# EAGLE design LLOAD_DB9_Adapter (EAGLE 6.6.0)
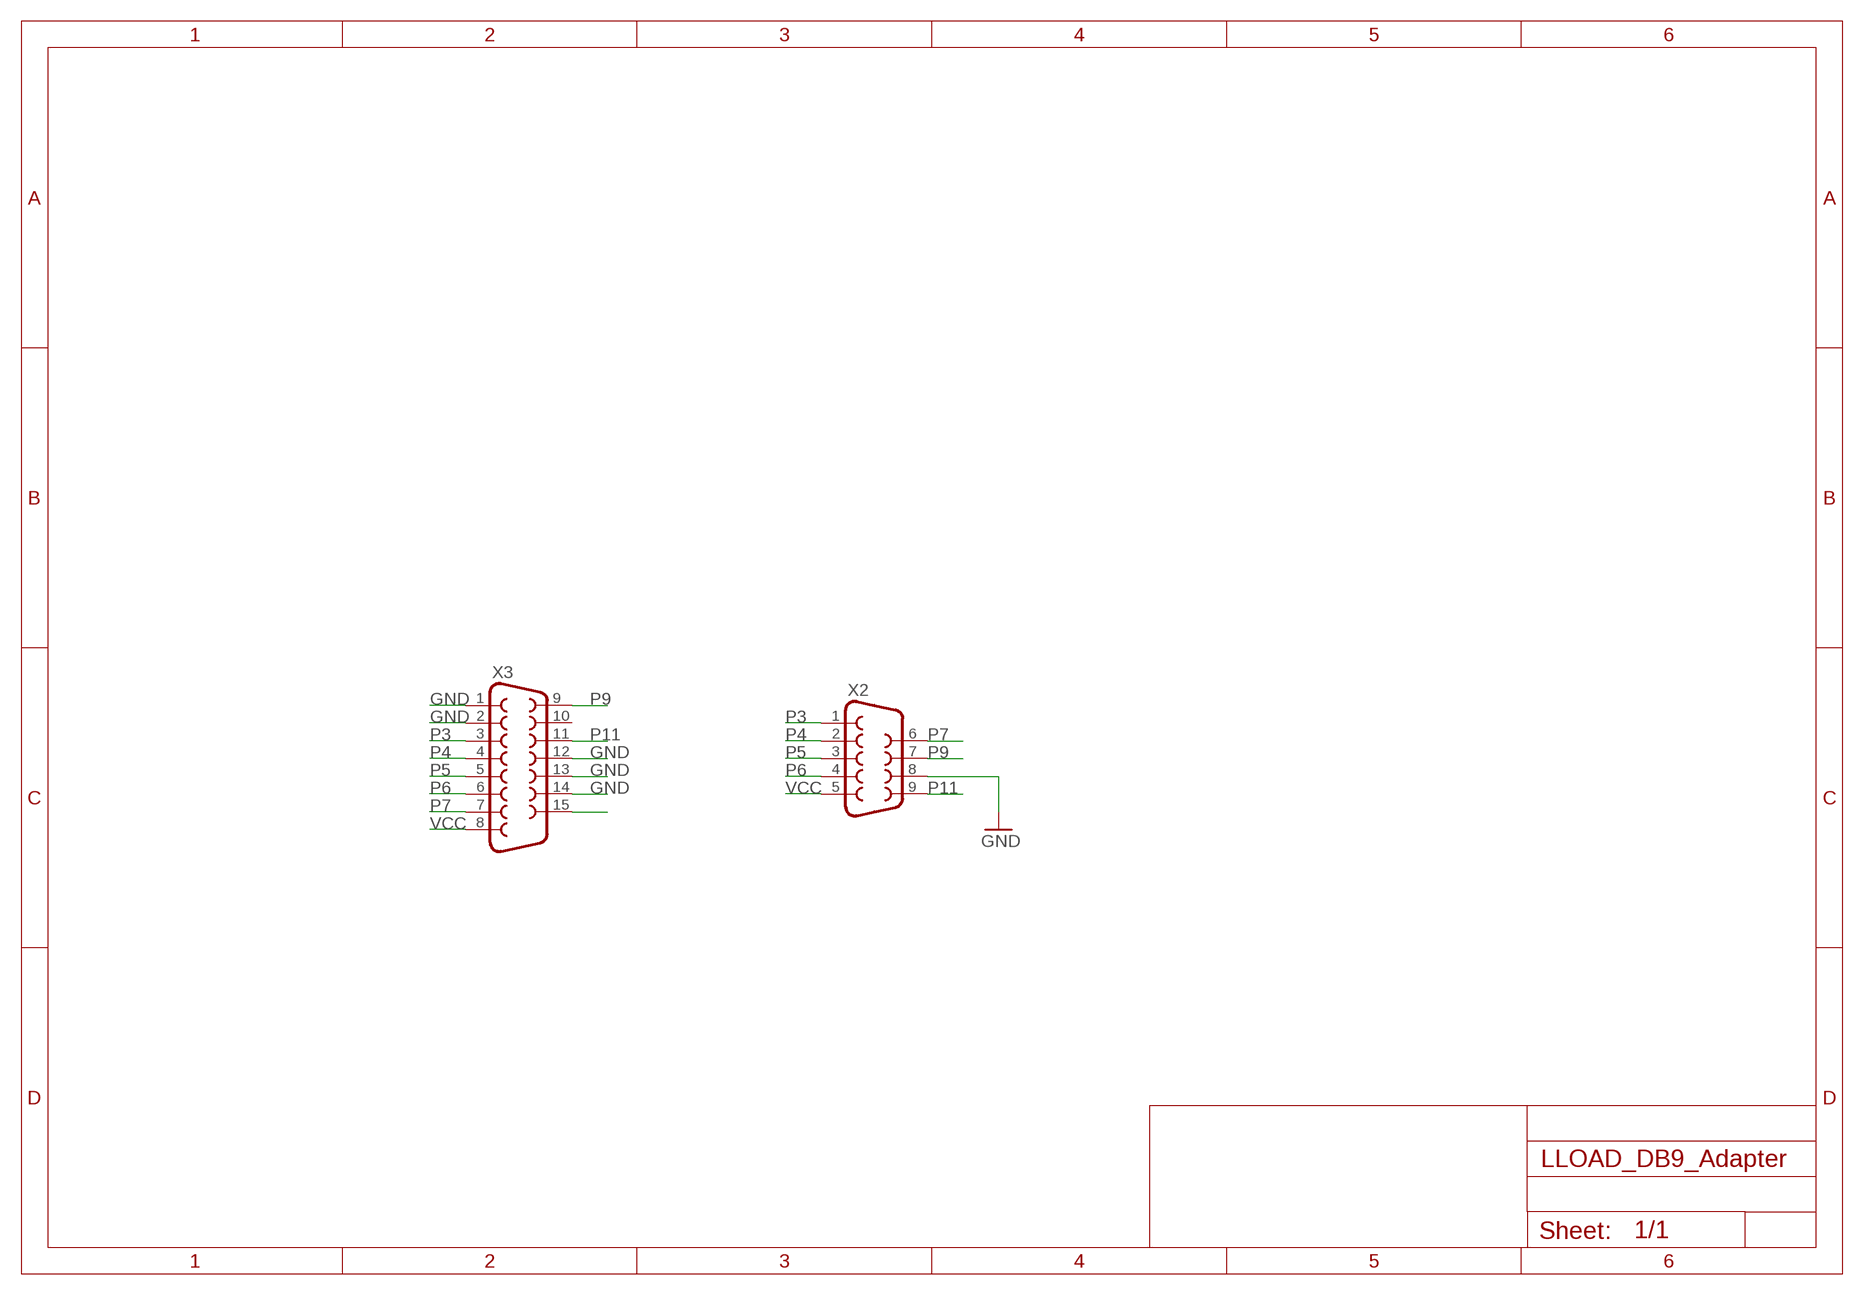
[diagram p0: schematic, sheet 1]

## Parts
X2  DB9MALE  [DB9_MALE]
X3  F15HP  [F15HP]

## Nets
GND: X2.8 X3.1 X3.2 X3.12 X3.13 X3.14
N$4: X3.15
P3: X2.1 X3.3
P4: X2.2 X3.4
P5: X2.3 X3.5
P6: X2.4 X3.6
P7: X2.6 X3.7
P9: X2.7 X3.9
P11: X2.9 X3.11
VCC: X2.5 X3.8
Unconnected: X3.10

## Library data of the parts
X2 = SparkFun:DB9: DB9 Connector Standard DB9 (D-Sub 9) serial connector. Can be used for CAN bus as well as RS485 and RS232. Footprint production proven. Spark Fun Electronics SKU : PRT-00429
X3 = con-subd:F15: SUB-D; OC_FARNELL: unknown; OC_NEWARK: unknown

## Board
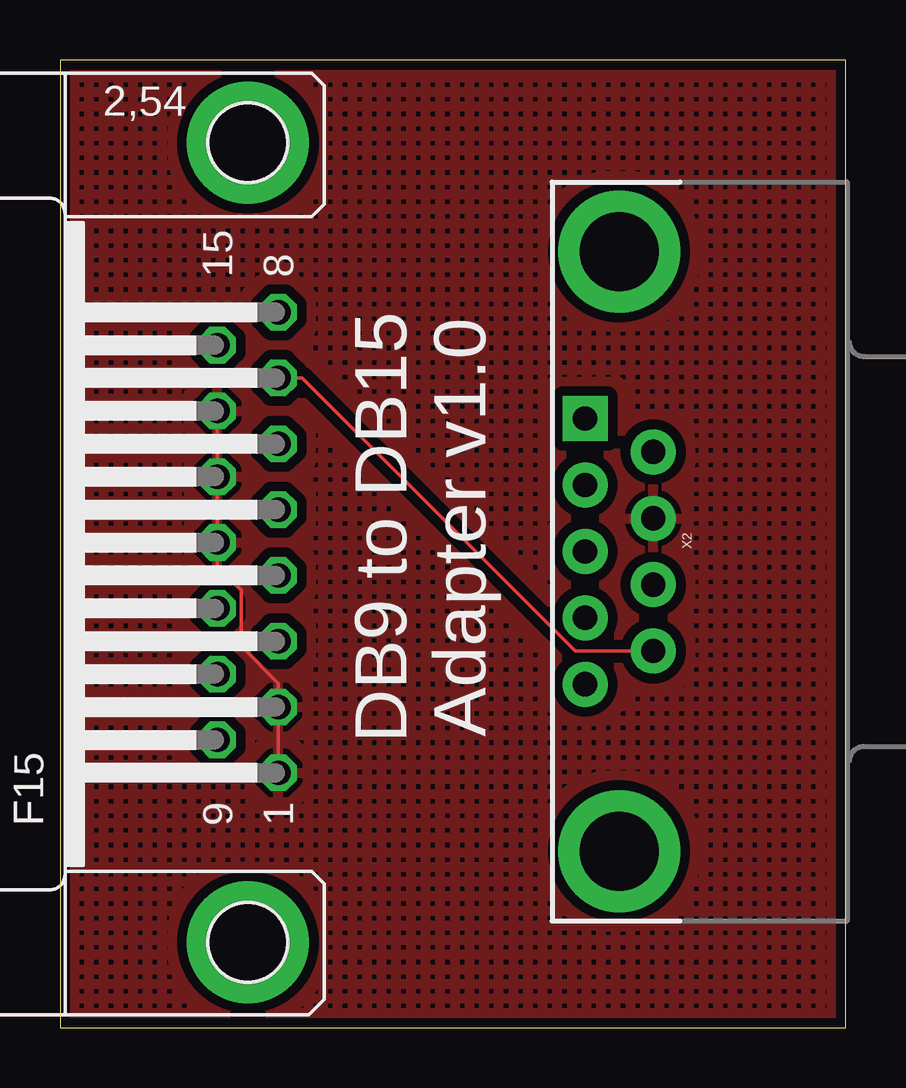
[diagram p1: board, top side]
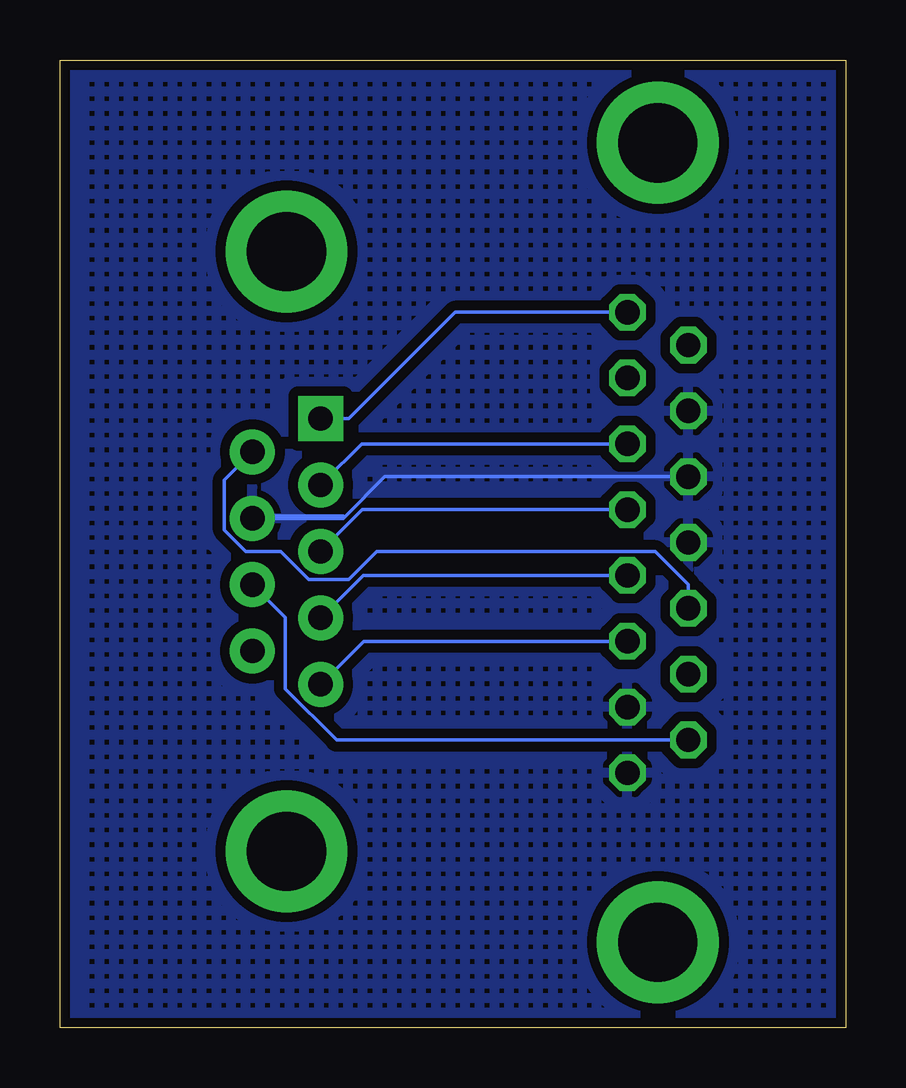
[diagram p2: board, bottom side, seen from below]

Size 32.74 x 40.34 mm. Coordinates in mm from the lower left corner, seen from the top.
Outline: 0,40.34 0,0 32.74,0 32.74,40.34 0,40.34
Copper layers (1*16): Top 0.035mm / dielectric 1.5mm / Bottom 0.035mm
Design rules "SeeedStudio_2layer_DRU_no_angle_20140221": minimum track width 6mil, minimum drill 12mil, track to track 6mil, track to pad 6mil, pad to pad 6mil, via to via 6mil, smd to smd 0mil, copper to edge 10mil, drill to drill 10mil, minimum pad ring 10mil, minimum via ring 6mil, stop-mask expansion 2mil, vias tented up to drill 100mil, thermal gap 10mil

### Footprints (pad centres in the part's own frame; a part is rotated, then mirrored left to right if it is on the bottom)
DB9_MALE = drill 1.016 pad 1.88: 1 5.54,-1.42; 2 2.77,-1.42; 3 0,-1.42; 4 -2.77,-1.42; 6 4.15,1.42; 7 1.38,1.42; 8 -1.38,1.42; 9 -4.15,1.42 | drill 1.016 pad 1.88 square: 5 -5.54,-1.42 | drill 3.302 pad 5.08: G1 -12.5,0; G2 12.5,0
F15HP = drill 1.016 octagon: 1 -9.601,-1.27; 2 -6.858,-1.27; 3 -4.115,-1.27; 4 -1.372,-1.27; 5 1.372,-1.27; 6 4.115,-1.27; 7 6.858,-1.27; 8 9.601,-1.27; 9 -8.23,1.27; 10 -5.486,1.27; 11 -2.743,1.27; 12 0,1.27; 13 2.743,1.27; 14 5.486,1.27; 15 8.23,1.27 | drill 3.302 pad 5.08: G1 -16.662,0; G2 16.662,0

### Placement (x,y rotation side)
X2  23.3,19.85 270 top
X3  7.83,20.22 90 top

### Tracks (layer width: path | path; a pad name or v marks a point on that pad's centre or on a via)
GND
  Top 0.152: X3.1 X3.2 9.1,14.35 7.55,15.9 7.55,18.24 6.56,19.23 X3.12 X3.13 X3.14
  Bottom 0.152: X3.13 19.2,22.96 20.88,21.28 | 20.88,21.28 20.93,21.23 X2.8 24.59,21.34 20.93,21.34 20.88,21.28
  pour Bottom (isolate 0.406, hatched): 0.05,40.25 32.65,40.25 32.65,-0.05 0.05,-0.05
  pour Top (isolate 0.406, hatched): 0.15,40.35 32.7,40.35 32.7,0 0.15,0
P3
  Bottom 0.152: X3.3 20.08,16.11 21.75,14.44 | 21.75,14.44 X2.1 21.74,14.43 21.75,14.44
P4
  Bottom 0.152: X3.4 20.11,18.85 X2.2 | X2.2 21.95,17.07 X2.2
P5
  Bottom 0.152: X3.5 20.14,21.59 21.78,19.95 | 21.78,19.95 X2.3 21.74,19.91 21.78,19.95
P6
  Bottom 0.152: X3.6 20.16,24.34 21.74,22.76 | 21.74,22.76 X2.4 21.74,22.76 | 21.74,22.76
P7
  Top 0.152: X3.7 10.09,27.08 21.47,15.7 24.59,15.7 | 24.59,15.7 X2.6 | X2.6 | X2.6 24.59,15.65 24.59,15.7
P9
  Bottom 0.152: X2.7 23.35,17.1 23.35,14.12 21.22,11.99 X3.9 | X2.7 24.79,18.49 X2.7
P11
  Bottom 0.152: X3.11 6.56,18.47 7.93,19.84 19.55,19.84 20.71,18.68 22.37,18.68 23.54,19.85 24.99,19.85 25.89,20.75 25.89,22.83 24.77,23.95 | 24.77,23.95 X2.9 24.79,23.98 24.77,23.95
VCC
  Bottom 0.152: X2.5 20.71,25.39 16.28,29.82 X3.8 | X2.5 21.95,25.4 X2.5

### Text on the board
tPlace: DB9 to DB15 / Adapter v1.0